# Altium project Tutorial.PrjPcb
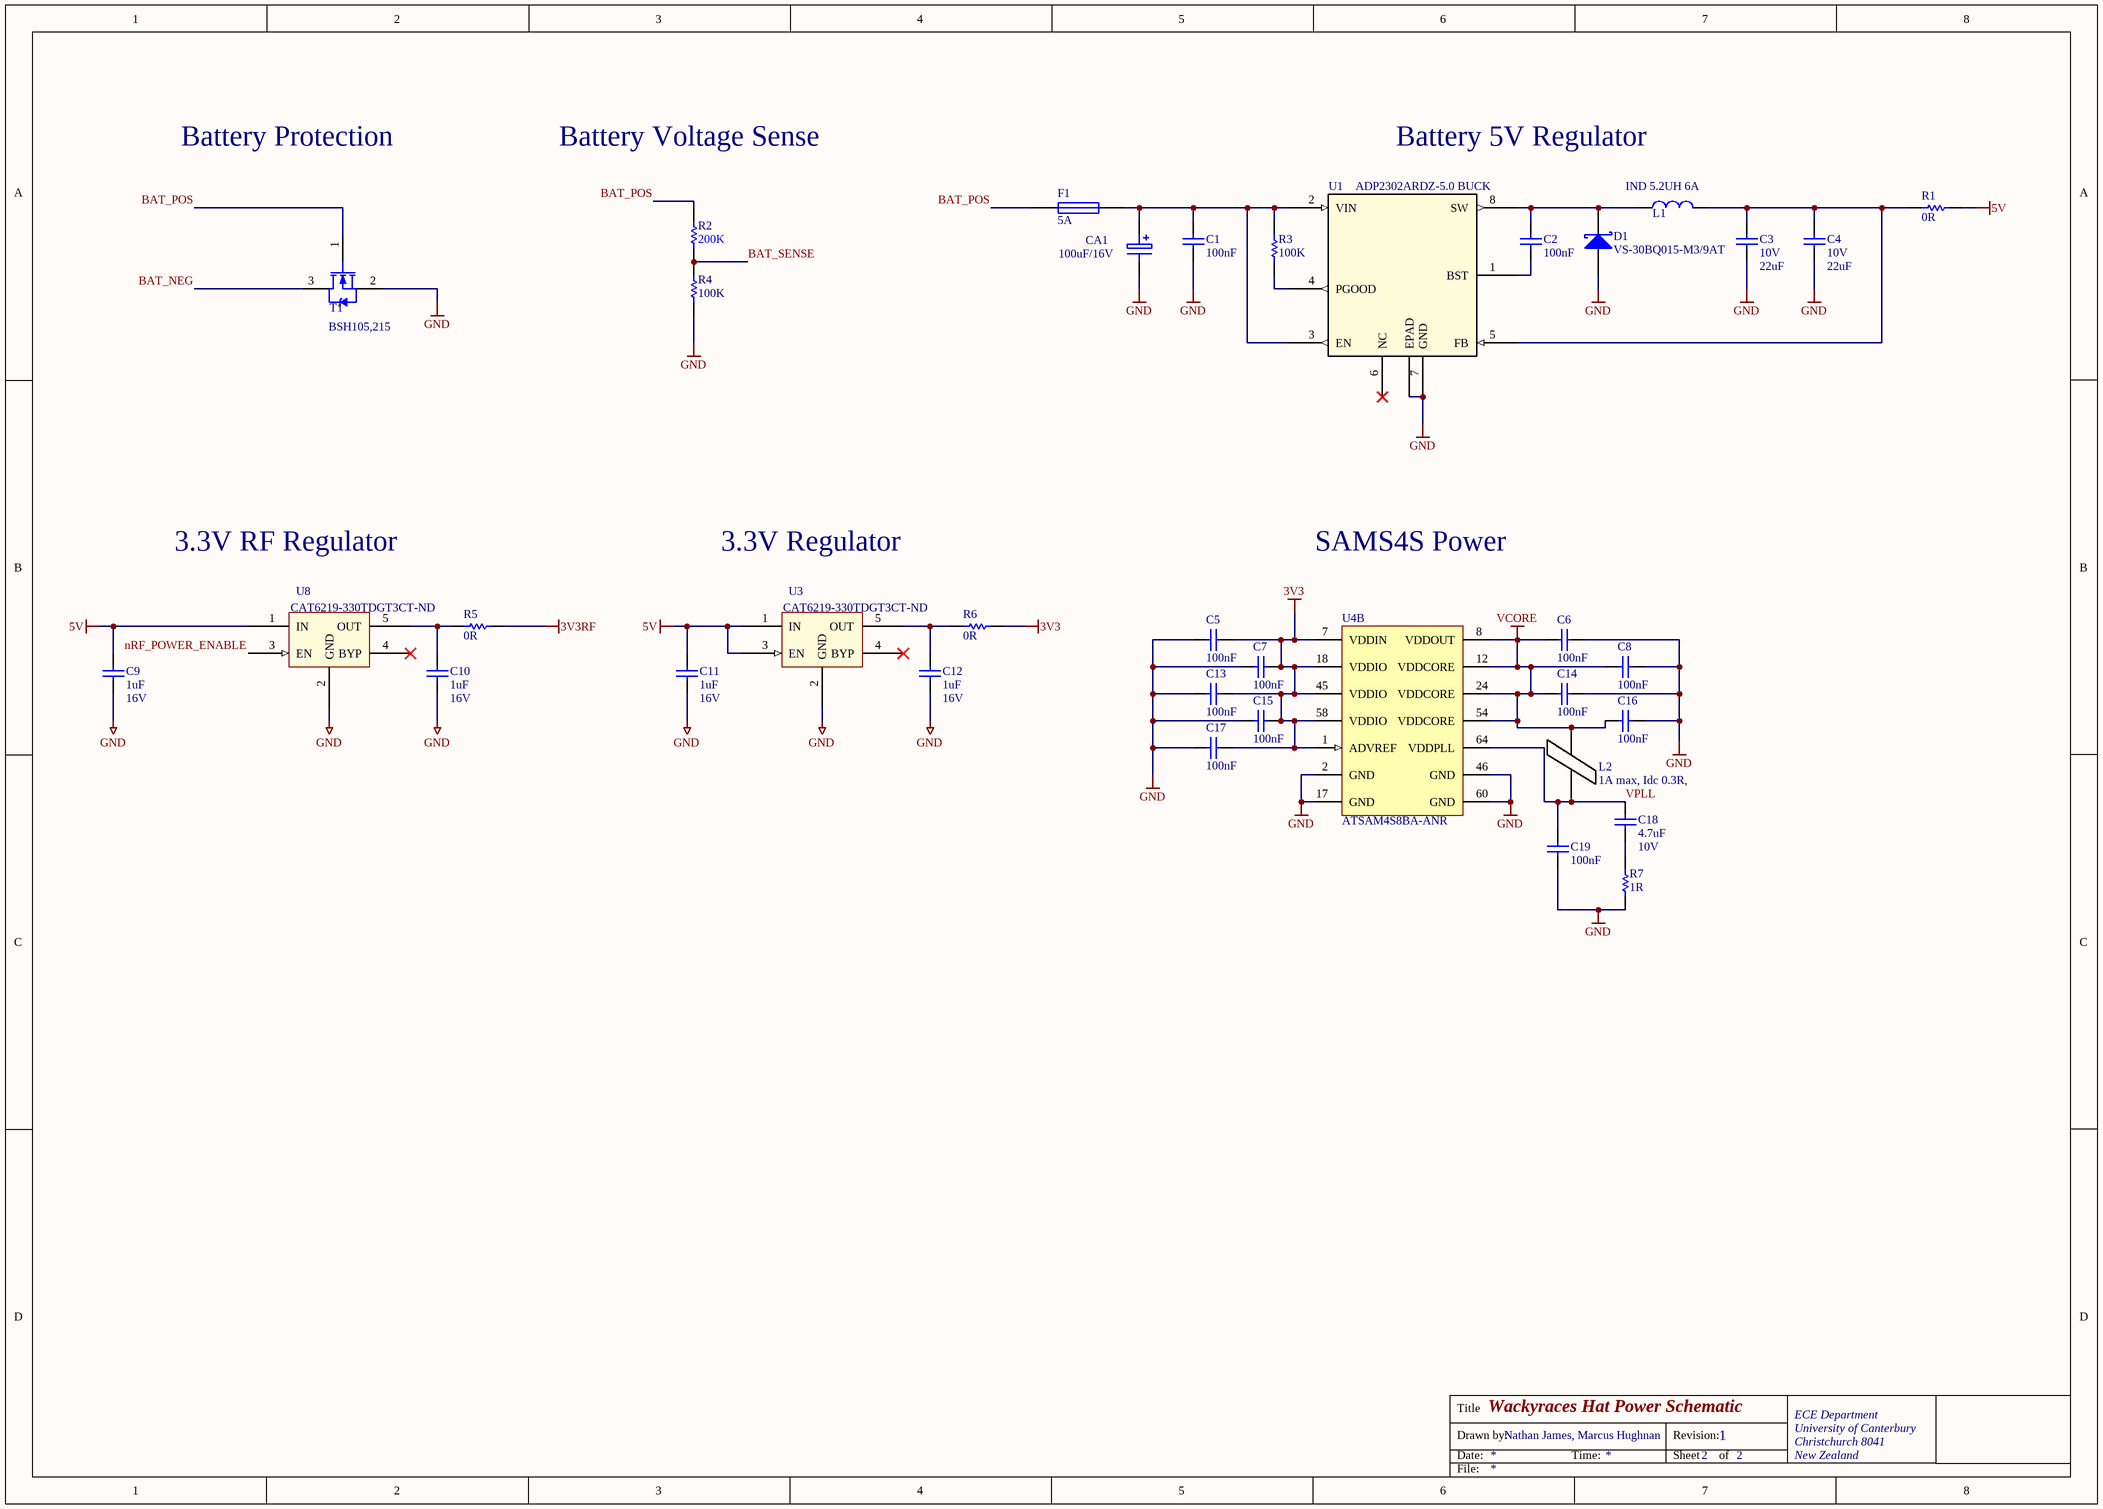
[diagram p0: Power Sheet.SchDoc]
2 sheets, 69 parts. Net scope: global (net labels, ports and power ports of the same name join across sheets).
Board file: hat_template 2020V3.PcbDoc
Sheets:
  Power Sheet.SchDoc
  Main Sheet.SchDoc

## Sheet Power Sheet.SchDoc: Wackyraces Hat Power Schematic
size A3; DrawnBy: Nathan James, Marcus Hughnan; Address1: ECE Department; Address2: University of Canterbury; Address3: Christchurch 8041; Address4: New Zealand; Revision: 1; SheetNumber: 2; SheetTotal: 2

### Parts
C1  100nF  [CAPC1608L]
C2  100nF  [CAPC1608L]
C3  Max Voltage: 10V  [CAPC3216L]  (hidden comment: 22uF)
C4  Max Voltage: 10V  [CAPC3216L]  (hidden comment: 22uF)
C5  100nF  [CAPC1608L]
C6  100nF  [CAPC1608L]
C7  100nF  [CAPC1608L]
C8  100nF  [CAPC1608L]
C9  Max Voltage: 16V  [CAPC1608L]  (hidden comment: 1uF)
C10  Max Voltage: 16V  [CAPC1608L]  (hidden comment: 1uF)
C11  Max Voltage: 16V  [CAPC1608L]  (hidden comment: 1uF)
C12  Max Voltage: 16V  [CAPC1608L]  (hidden comment: 1uF)
C13  100nF  [CAPC1608L]
C14  100nF  [CAPC1608L]
C15  100nF  [CAPC1608L]
C16  100nF  [CAPC1608L]
C17  100nF  [CAPC1608L]
C18  Max Voltage: 10V  [CAPC1608N]  (hidden comment: 4.7uF)
C19  100nF  [CAPC1608L]
CA1  100uF/16V  [NICH-1]
D1  VS-30BQ015-M3/9AT  [SMC]
F1  5A  [RESC3216N]
L1  IND 5.2UH 6A  [INDUCTOR5u2]
L2  1A max, Idc 0.3R,  [INDC3216L]
R1  0R  [RESC1608L]
R2  200K  [RESC1608L]
R3  100K  [RESC1608L]
R4  100K  [RESC1608L]
R5  0R  [RESC1608L]
R6  0R  [RESC1608L]
R7  1R  [RESC3216L]
T1  BSH105,215  [SOT23_L]
U1  ADP2302ARDZ-5.0 BUCK  [RD_8_1]
U3  Supplier Part Number: CAT6219-330TDGT3CT-ND  [SOT95P280X145-5N]  (hidden comment: CAT6219-330TDGT3)
U4  ATSAM4S8BA-ANR  [LQFP64_L]  (part B of 2)
U8  Supplier Part Number: CAT6219-330TDGT3CT-ND  [SOT95P280X145-5N]  (hidden comment: CAT6219-330TDGT3)

### Nets
3V3: C5.2 C7.2 C13.2 C15.2 C17.2 R6.2 U4.1(ADVREF) U4.7(VDDIN) U4.18(VDDIO) U4.45(VDDIO) U4.58(VDDIO)
3V3RF: R5.2
5V: C9.2 C11.2 R1.2 U3.1(IN) U3.3(EN) U8.1(IN)
GND: C1.1 C3.1 C4.1 C5.1 C6.2 C7.1 C8.2 C9.1 C10.1 C11.1 C12.1 C13.1 C14.2 C15.1 C16.2 C17.1 C19.1 CA1.1 D1.1(A) R4.1 R7.1 T1.2 U1.7(GND) U1.EPAD U3.2(GND) U4.2(GND) U4.17(GND) U4.46(GND) U4.60(GND) U8.2(GND)
VCORE: C6.1 C8.1 C14.1 C16.1 L2.2 U4.8(VDDOUT) U4.12(VDDCORE) U4.24(VDDCORE) U4.54(VDDCORE)
BAT_NEG: T1.3
BAT_POS: F1.1 R2.2 T1.1
BAT_SENSE: R2.1 R4.2
nRF_POWER_ENABLE: U8.3(EN)
VPLL: C18.2 C19.2 L2.1 U4.64(VDDPLL)
NetC1_2: C1.2 CA1.2 F1.2 R3.1 U1.2(VIN) U1.3(EN)
NetC2_1: C2.1 U1.1(BST)
NetC2_2: C2.2 D1.2(K) L1.1 U1.8(SW)
NetC3_2: C3.2 C4.2 L1.2 R1.1 U1.5(FB)
NetC10_2: C10.2 R5.1 U8.5(OUT)
NetC12_2: C12.2 R6.1 U3.5(OUT)
NetC18_1: C18.1 R7.2
NetR3_2: R3.2 U1.4(PGOOD)

Not connected (* = marked no-connect by the designer): U1 6(NC)*; U3 4(BYP)*; U8 4(BYP)*

### Notes on the sheet
- Battery Protection
- Battery Voltage Sense
- Battery 5V Regulator
- 3.3V RF Regulator
- 3.3V Regulator
- SAMS4S Power
- Title
- Drawn by:
- Date:
- Time:
- Revision:
- Sheet
- of
- File:

### Library data of the parts
C1 C2 C5-C8 C13-C17 C19 = CC_100nF_0603: CAP CER 100nF X7R +-10% 50V 0603; PackageReference: 0603; Code_IPC: 1608 [0603]; Verify: *; Supplier: ECE Dept; Storage Location: PCB Assembly WS; Value: 100nF
C3 C4 = CC_22uF_1206: CAP CER 22uF Y5V -20% +80% 10V 1206; Verify: *; Supplier: ECE Dept; Storage Location: PCB Assembly WS; Dielectric: Y5V; Footprint: 1206 (3216 metric); Value: 22uF
C9-C12 = CC_1uF_0603: CAP CER 1uF Y5V -20% +80% 16V 0603; PackageReference: 0603; Code_IPC: 1608 [0603]; Verify: *; Supplier: ECE Dept; Storage Location: PCB Assembly WS; Value: 1uF
C18 = CC_4.7uF_0603: CAP CER 4.7uF X5R +-20%  10V 0603; Note: Footprint corresponds to dimensions for bulk cassette packaging. This case size has tightened tolerances.; PackageReference: 0805; Code_IPC: 2012[0805]; Verify: *; Supplier: ECE Dept; Storage Location: PCB Assembly WS; Value: 4.7uF
CA1 = CA_100uF_16V: CAP ALUM 100uF 16V SMD; Manufacturer PN: UWX1C101MCL1GB; Manufacturer: Nichcon; Supplier 1: Farnell; Supplier Part Number 1: 1870677; Storage Location: PCB Assembly WS; Supplier: ECE Dept; Supplier 2: Digi-Key; Supplier Part Number 2: 493-2105-1-ND; Value: 100uF/16V
D1 = DS_VS-30BQ015-M3: DIODE, SCHOTTKY, 3A, 15V, DO-214AB / SMC; Manufacturer: Vishay Semiconductors; Forward Voltage: 350mV; Max Forward Surge Current (Ifsm): 650A; Peak Reverse Current: 4mA; Average Rectified Current: 3A; Max Reverse Voltage (DC): 15V; Supplier: Digi-Key; ComponentLink1URL: https://datasheet.ciiva.com/36181/vs-30bq015-m3-9at-36181258.pdf; ComponentLink1Description: https://datasheet.ciiva.com/36181/vs-30bq015-m3-9at-36181258.pdf; Supplier 1: Digi-Key; Supplier 2: Element14; Supplier Part Number 1: VS-30BQ015-M3/9ATGIDKR-ND; Supplier Part Number 2: 2628288; Supplier Part Number: VS-30BQ015-M3/9AT-ND; Manufacturer Part Number: VS-30BQ015-M3/9AT
F1 = FS_Fuse_5.0A: Fuse 5.0A Fast Acting 1206 SMD; Manufacturer Part Number: C1F5; Manufacturer: Bel TRP; Voltage Rating (AC): 125V; Voltage Rating (DC): 63V; DC Cold Resistance: 19mR; Fuse Type: Board Mount (Cartridge Style Excluded); Approvals: CE,cURus; Mount: Surface Mount; Case/Package: 1206; Number of Pins: 2; Case Code (Metric): 3216; Case Code (Imperial): 1206; Contact Plating: Nickel,Tin; Min Operating Temperature: -55°C; Max Operating Temperature: 125°C; Packaging: Tape and Reel; Voltage Rating: 125V; Length: 0.126inch; Width: 0.062inch; Supplier 1: Digi-Key; Stock 1: 725; Pricing 1: 1=0.32, 5=0.312, 10=0.298, 50=0.2662, 100=0.2479, 250=0.22032, 500=0.1836, 1000=0.17442 (USD); ComponentLink1URL: http://www.farnell.com/datasheets/2571625.pdf; ComponentLink1Description: http://www.farnell.com/datasheets/2571625.pdf; ComponentLink2URL: http://belfuse.com/pdfs/C1F.pdf; ComponentLink2Description: http://belfuse.com/pdfs/C1F.pdf; ComponentLink3URL: http://www.mouser.com/ds/2/643/C1F-594910.pdf; ComponentLink3Description: http://www.mouser.com/ds/2/643/C1F-594910.pdf; ComponentLink4URL: https://belfuse.com/resources/StewartConnector/C1F.pdf; ComponentLink4Description: https://belfuse.com/resources/StewartConnector/C1F.pdf; Current Rating: 5A; Supplier Part Number 1: 507-1886-1-ND; Supplier 2: Element14; Supplier Part Number 2: 2848595; Value: 5A
L1 = CDRH104RNP-5R2NC: FIXED IND 5.2UH 6A 22 MOHM SMD; Manufacturer: Sumida America Components Inc.; Material - Core: Ferrite; Tolerance: ±30%; Current - Saturation: 5.6A; Shielding: Shielded; DC Resistance (DCR): 22 mOhm Max; Supplier 1: Digi-Key; Manufacturer Part Number: CDRH104RNP-5R2NC; RoHS: RoHS Compliant; Category: Inductors, Coils, Chokes; Stock 1: 3849; Pricing 1: 1=2.9, 10=2.678, 100=1.8743, 500=1.5173 (NZD); Packaging: Cut Tape (CT); Part Status: Active; Type: -; Q @ Freq: -; Frequency - Self Resonant: -; Ratings: -; Operating Temperature: -40°C ~ 100°C; Mounting Type: Surface Mount; Package / Case: Nonstandard; Supplier Device Package: -; Size / Dimension: 0.402" L x 0.394" W (10.20mm x 10.00mm); Height - Seated (Max): 0.157" (4.00mm); ComponentLink1URL: http://products.sumida.com/products/pdf/CDRH104R.pdf; ComponentLink1Description: http://products.sumida.com/products/pdf/CDRH104R.pdf; Supplier Part Number 1: 308-2280-1-ND
L2 = IN_Ferrite-Bead: Ferrite Bead, Rdc 0.3R, Z100MHZ 600R, Imax 1A, SMD 1206; Manufacturer: FAIR-RITE; Manufacturer PN: 2512066017Y1; DC Current Rating: 1; DC Resistance Max: 0.08; Ferrite Case Style: 1206 ^3216 Metric]; Frequency Range: 50MHz to 1; Impedance: 600; Impedance Tolerance: ± 25%; Supplier: ECE Dept; Storage Location: PCB Assembly WS; Ferrite Mounting: SMD; Supplier 1: Farnell; Supplier Part Number 1: 1612060; Manufacturer Part Number: 2512066017Y1; Value: 1A max, Idc 0.3R,
R1 R5 R6 = RS_0R0: RES 0.0 OHM 1/10W 5% 0603 SMD; Storage Location: PCB Assembly WS; Supplier: ECE Dept; Value: 0R
R2 = RS_200K: RES 200K OHM 1/10W 5% 0603 SMD; Storage Location: PCB Assembly WS; Supplier: ECE Dept; Value: 200K
R3 R4 = RS_100K: RES 100K OHM 1/10W 5% 0603 SMD; Storage Location: PCB Assembly WS; Supplier: ECE Dept; Value: 100K
R7 = RT_1R: RES 1R OHM 1/4W 5% 1206 SMD; Storage Location: PCB Assembly WS; Supplier: ECE Dept; Value: 1R
T1 = TM_BSH105: MOSFET N-CH 20V 1.05A SOT-23; Manufacturer: NXP Semiconductors; FET Type: MOSFET N-Channel, Metal Oxide; Gate Charge (Qg) @ Vgs: 3.9nC @ 4.5V; Input Capacitance (Ciss) @ Vds: 152pF @ 16V; Power - Max: 417mW; Rds On (Max) @ Id, Vgs: 200 mOhm @ 600mA, 4.5V; Supplier 1: Farnell; Supplier 2: Digi-Key; Current - Continuous Drain (Id) @ 25° C: 1.05A; Drain to Source Voltage (Vdss): 20V; Package / Case: TO-236-3, SC-59, SOT-23-3; Pricing: 1=0.53, 10=0.42, 25=0.3544, 100=0.2885, 250=0.23896, 500=0.1974, 1000=0.14785 (NZD); Supplier Part Number 1: 1758066; Supplier Part Number 2: 568-6215-1-ND; Storage Location: PCB Assembly WS; Supplier: ECE Dept; Manufacturer Part Number: BSH105,215
U1 = ADP2302ARDZ-5.0-R7: IC REG BUCK 5V 2A 8SOIC; Vendor: Analog Devices Inc; Frequency - Switching: 700kHz; Output Type: Fixed; Voltage - Input (Max): 20V; Manufacturer_Part_Number: ADP2302ARDZ-5.0-R7; Type: DEV; Value: Value; Supplier 1: Digi-Key; Current - Output: 2A; Voltage - Output (Min/Fixed): 5V; Supplier Part Number 1: ADP2302ARDZ-5.0-R7CT-ND
U3 U8 = SV_CAT6219-330TDGT3: IC REG LIN 3.3V 500MA TSOT23-5; Voltage - Input (Max): 5.5V; Voltage Dropout (Max): 0.5V @ 500mA; Manufacturer Part Number: CAT6219-330TDGT3; Base Part Number: CAT6219; Current - Output: 500mA; Package / Case: SOT-23-5 Thin, TSOT-23-5; Supplier: Digi-Key; Supplier Device Package: TSOT-23-5; Voltage - Output (Min/Fixed): 3.3V; ComponentLink1URL: http://www.onsemi.com/pub/Collateral/CAT6219-D.PDF; ComponentLink1Description: http://www.onsemi.com/pub/Collateral/CAT6219-D.PDF; Supplier 1: Digi-Key
U4 = SE_ATSAM4S16BA-MU: IC MCU 32BIT 512KB FLASH 64LQFP; Manufacturer: Atmel; Connectivity: I²C, IrDA, Memory Card, SPI, SSC, UART/USART, USB; Core Processor: ARM® Cortex®-M4; Core Size: 32-Bit; Data Converters: A/D 11x12b, D/A 2x12b; Number of I/O: 47; Peripherals: Brown-out Detect/Reset, DMA, POR, PWM, WDT; Program Memory Size: 512KB (512K x 8); RAM Size: 128K x 8; Speed: 120MHz; Voltage - Supply (Vcc/Vdd): 1.62 V ~ 3.6 V; PackageVersion: revJ, Jul-2007; PackageReference: 64PS; PackageDescription: 64-Pin Quad Flat No-Lead (QFN) Sawn, 9 x 9 x 1.0 mm Body, 0.5 mm Pitch, Exposed Pad; Code_JEDEC: MO-220VMMD-3; ComponentLink1Description: Manufacturer URL; ComponentLink1URL: http://www.atmel.com/; ComponentLink2Description: SAM4S Series Datasheet; ComponentLink2URL: http://www.atmel.com/dyn/resources/prod_documents/11100.pdf; ComponentLink3Description: SAM4S Series Summary; ComponentLink3URL: http://www.atmel.com/dyn/resources/prod_documents/11100S.pdf; Supplier 1: Digi-Key; Package / Case: 64-LQFP; Packaging: Cut Tape (CT); Program Memory Type: FLASH; Supplier Part Number 1: ATSAM4S8BA-ANRCT-ND; Manufacturer Part Number: ATSAM4S8BA-ANR

## Sheet Main Sheet.SchDoc: Wackyraces Hat Main Schemetic
size A3; DrawnBy: Nathan James, Marcus Hughnan; Address1: ECE Department; Address2: University of Canterbury; Address3: Christchurch 8041; Address4: New Zealand; Revision: 1; SheetNumber: 1; SheetTotal: 2
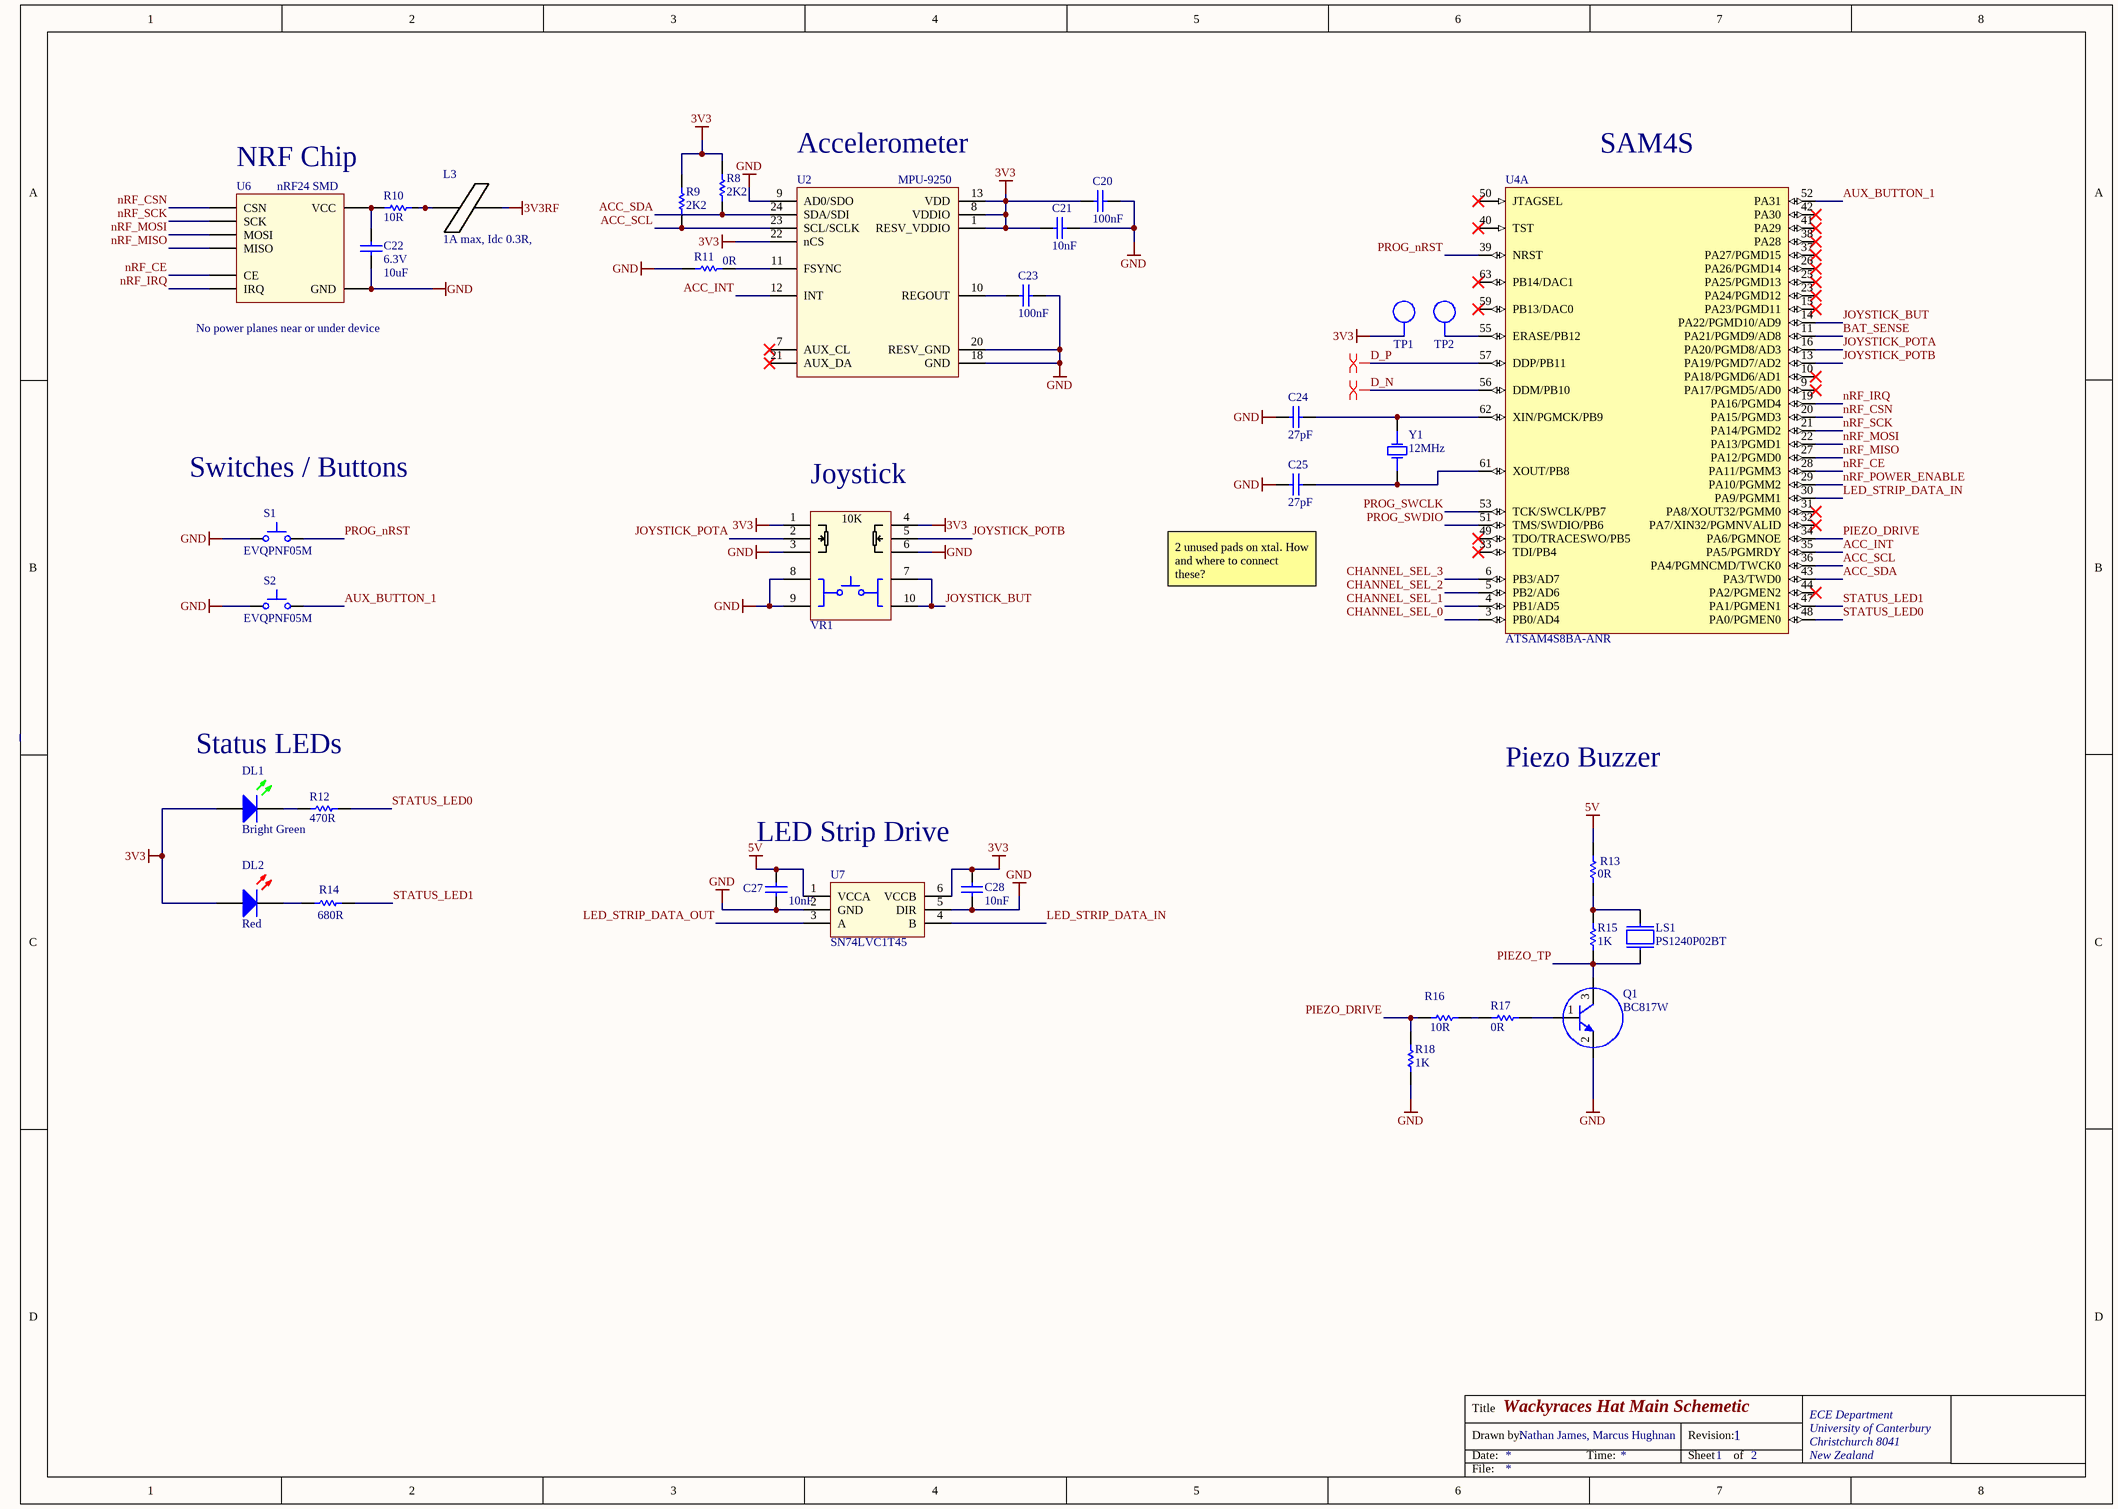
[diagram p1: Main Sheet.SchDoc]

### Parts
C20  100nF  [CAPC1608L]
C21  10nF  [CAPC1608L]
C22  Voltage - Rated: 6.3V  [CAPC1608L]  (hidden comment: 10uF)
C23  100nF  [CAPC1608L]
C24  27pF  [CAPC1608L]
C25  27pF  [CAPC1608L]
C27  10nF  [CAPC1608L]
C28  10nF  [CAPC1608L]
DL1  Bright Green  [WL-SMCW0603]
DL2  Red  [WL-SMCW0603]
L3  1A max, Idc 0.3R,  [INDC3216L]
LS1  PS1240P02BT  [XDCR_PS1240P02BT]
Q1  BC817W  [SOT323_M]
R8  2K2  [RESC1608L]
R9  2K2  [RESC1608L]
R10  10R  [RESC1608L]
R11  0R  [RESC1608L]
R12  470R  [RESC1608L]
R13  0R  [RESC1608L]
R14  680R  [RESC1608L]
R15  1K  [RESC1608L]
R16  10R  [RESC1608L]
R17  0R  [RESC1608L]
R18  1K  [RESC1608L]
S1  EVQPNF05M  [EVQPNF05M]
S2  EVQPNF05M  [EVQPNF05M]
TP1  Erase  [TP_1206]  (value not drawn)  (no BOM)
TP2  Erase  [TP_1206]  (value not drawn)  (no BOM)
U2  MPU-9250  [Quad24]
U4  ATSAM4S8BA-ANR  [LQFP64_L]  (part A of 2)
U6  nRF24 SMD  Warning: No power planes near or under device  [NRF24]
U7  SN74LVC1T45  [SOT23-6_N]
VR1  Joystick 10k with Sw  [Joystick_Sw]  (value not drawn)
Y1  12MHz  [6.0X3.5-4]

### Nets
3V3: C20.1 C21.1 C28.2 DL1.2(A) DL2.2(A) R8.2 R9.1 TP1.1 U2.1(RESV_VDDIO) U2.8(VDDIO) U2.13(VDD) U2.22(nCS) U7.6(VCCB) VR1.1 VR1.4(1')
3V3RF: L3.1
5V: C27.2 R13.2 U7.1(VCCA)
GND: C20.2 C21.2 C22.1 C23.2 C24.1 C25.1 C27.1 C28.1 Q1.2 R11.1 R18.1 S1.1 S2.1 U2.9(AD0/SDO) U2.18(GND) U2.20(RESV_GND) U6.2(GND) U7.2(GND) U7.5(DIR) VR1.3 VR1.6(3') VR1.8 VR1.9
ACC_INT: U2.12(INT) U4.35(PA5/PGMRDY)
ACC_SCL: R9.2 U2.23(SCL/SCLK) U4.36(PA4/PGMNCMD/TWCK0)
ACC_SDA: R8.1 U2.24(SDA/SDI) U4.43(PA3/TWD0)
AUX_BUTTON_1: S2.2 U4.52(PA31)
BAT_SENSE: U4.11(PA21/PGMD9/AD8)
CHANNEL_SEL_0: U4.3(PB0/AD4)
CHANNEL_SEL_1: U4.4(PB1/AD5)
CHANNEL_SEL_2: U4.5(PB2/AD6)
CHANNEL_SEL_3: U4.6(PB3/AD7)
D_N: U4.56(DDM/PB10)
D_P: U4.57(DDP/PB11)
JOYSTICK_BUT: U4.14(PA22/PGMD10/AD9) VR1.7 VR1.10
JOYSTICK_POTA: U4.16(PA20/PGMD8/AD3) VR1.2
JOYSTICK_POTB: U4.13(PA19/PGMD7/AD2) VR1.5(2')
LED_STRIP_DATA_IN: U4.30(PA9/PGMM1) U7.4(B)
LED_STRIP_DATA_OUT: U7.3(A)
nRF_CE: U4.28(PA11/PGMM3) U6.3(CE)
nRF_CSN: U4.20(PA15/PGMD3) U6.4(CSN)
nRF_IRQ: U4.19(PA16/PGMD4) U6.8(IRQ)
nRF_MISO: U4.27(PA12/PGMD0) U6.7(MISO)
nRF_MOSI: U4.22(PA13/PGMD1) U6.6(MOSI)
nRF_POWER_ENABLE: U4.29(PA10/PGMM2)
nRF_SCK: U4.21(PA14/PGMD2) U6.5(SCK)
PIEZO_DRIVE: R16.1 R18.2 U4.34(PA6/PGMNOE)
PIEZO_TP: LS1.1 Q1.3 R15.1
PROG_nRST: S1.2 U4.39(NRST)
PROG_SWCLK: U4.53(TCK/SWCLK/PB7)
PROG_SWDIO: U4.51(TMS/SWDIO/PB6)
STATUS_LED0: R12.2 U4.48(PA0/PGMEN0)
STATUS_LED1: R14.2 U4.47(PA1/PGMEN1)
NetC22_2: C22.2 R10.1 U6.1(VCC)
NetC23_1: C23.1 U2.10(REGOUT)
NetC24_2: C24.2 U4.62(XIN/PGMCK/PB9) Y1.3(OSC2)
NetC25_2: C25.2 U4.61(XOUT/PB8) Y1.1(OSC1)
NetDL1_1: DL1.1(K) R12.1
NetDL2_1: DL2.1(K) R14.1
NetL3_2: L3.2 R10.2
NetLS1_2: LS1.2 R13.1 R15.2
NetQ1_1: Q1.1 R17.2
NetR11_2: R11.2 U2.11(FSYNC)
NetR16_2: R16.2 R17.1
NetTP2_1: TP2.1 U4.55(ERASE/PB12)

Not connected (* = marked no-connect by the designer): U2 7(AUX_CL)* 21(AUX_DA)*; U4 9(PA17/PGMD5/AD0)* 10(PA18/PGMD6/AD1)* 15(PA23/PGMD11)* 23(PA24/PGMD12)* 25(PA25/PGMD13)* 26(PA26/PGMD14)* 31(PA8/XOUT32/PGMM0)* 32(PA7/XIN32/PGMNVALID)* 33(TDI/PB4)* 37(PA27/PGMD15)* 38(PA28)* 40(TST)* 41(PA29)* 42(PA30)* 44(PA2/PGMEN2)* 49(TDO/TRACESWO/PB5)* 50(JTAGSEL)* 59(PB13/DAC0)* 63(PB14/DAC1)*

### Layout directives
differential pair: D_N, D_P

### Notes on the sheet
- NRF Chip
- (near U2) Accelerometer
- (near U4) SAM4S
- Switches / Buttons
- (near VR1) Joystick
- (near C25) 2 unused pads on xtal. How and where to connect these?
- Status LEDs
- Piezo Buzzer
- LED Strip Drive
- Title
- Drawn by:
- Date:
- Time:
- Revision:
- Sheet
- of
- File:
- (in symbol Joystick 10k with Sw) 10K

### Library data of the parts
C20 C23 = CC_100nF_0603: CAP CER 100nF X7R +-10% 50V 0603; PackageReference: 0603; Code_IPC: 1608 [0603]; Verify: *; Supplier: ECE Dept; Storage Location: PCB Assembly WS; Value: 100nF
C21 C27 C28 = CC_10nF_0603: CAP CER 10nF X7R +-10% 50V 0603; PackageReference: 0603; Code_IPC: 1608 [0603]; Verify: *; Supplier: ECE Dept; Storage Location: PCB Assembly WS; Value: 10nF
C22 = CC_10uF_0603: CAP CER 10UF X5R +-20% 6V3 0603; Supplier: ECE Dept; Storage Location: PCB Assembly WS; Value: 10uF
C24 C25 = CC_27pF_0603: CAP CER 27pF NPO/COG +-5% 50V 0603; PackageReference: 0603; Code_IPC: 1608 [0603]; Verify: *; Supplier: ECE Dept; Storage Location: PCB Assembly WS; Value: 27pF
DL1 = DL_150060VS75000: LED Bright Green 40mcd 0603 SMD; Manufacturer: WURTH ELEKTRONIK; Forward Current If: 30; Forward Voltage: 2; Viewing Angle: 140°; Wavelength Typ: 570; Luminous Intensity: 40; LED Mounting: SMD; Supplier 1: Farnell; Supplier Part Number 1: 2322073; Manufacturer Part Number: 150060VS75000; Storage Location: PCB Assembly WS; Supplier: ECE Dept; LED Colour: Bright Green
DL2 = DL_150060RS75000: LED Red 250mcd 0603 SMD; Manufacturer: WURTH ELEKTRONIK; Forward Current If: 30; Forward Voltage: 2; Lens Shape: Rectangular; Luminous Intensity: 250; Wavelength Typ: 625; Viewing Angle: 140°; LED Mounting: SMD; Supplier 1: Farnell; Supplier Part Number 1: 2322071; Manufacturer Part Number: 150060RS75000; Storage Location: PCB Assembly WS; Supplier: ECE Dept; LED Colour: Red
L3 = IN_Ferrite-Bead: as L2 on sheet Power Sheet; Supplier: ECE Dept; Storage Location: PCB Assembly WS; Ferrite Mounting: SMD; Supplier 1: Farnell; Supplier Part Number 1: 1612060; Manufacturer Part Number: 2512066017Y1; Value: 1A max, Idc 0.3R,
LS1 = PS1240P02BT: Buzzers Transducer, Externally Driven Piezo 3V 4kHz 60dB @ 3V, 10cm Through Hole PC Pins; MF: TDK; MP: PS1240P02BT; Availability: Unavailable; Package: 2020 TDK; Value: *; Price: None; SnapEDA_Link: https://www.snapeda.com/parts/PS1240P02BT/TDK/view-part/53420/?ref=snap
Q1 = TB_BC817W: NPN GP Bipolar Transistor 45V 500mA SOT323; Manufacturer: NXP; Supplier 1: Farnell; Supplier Part Number 1: 2114873; Manufacturer PN: BC817W; Storage Location: PCB Assembly WS; Supplier: ECE Dept; Value: BC817W
R8 R9 = RS_2K2: RES 2.2K OHM 1/10W 5% 0603 SMD; Storage Location: PCB Assembly WS; Supplier: ECE Dept; Value: 2K2
R10 R16 = RS_10R: RES 10 OHM 1/10W 5% 0603 SMD; Storage Location: PCB Assembly WS; Supplier: ECE Dept; Value: 10R
R11 R13 R17 = RS_0R0: RES 0.0 OHM 1/10W 5% 0603 SMD; Storage Location: PCB Assembly WS; Supplier: ECE Dept; Value: 0R
R12 = RS_470R: RES 470 OHM 1/10W 5% 0603 SMD; Storage Location: PCB Assembly WS; Supplier: ECE Dept; Value: 470R
R14 = RS_680R: RES 680 OHM 1/10W 5% 0603 SMD; Storage Location: PCB Assembly WS; Supplier: ECE Dept; Value: 680R
R15 R18 = RS_1K: RES 1.0K OHM 1/10W 5% 0603 SMD; Storage Location: PCB Assembly WS; Supplier: ECE Dept; Value: 1K
S1 S2 = WS_EVQPNF05M: Panasonic 6 x 3.5mm SMD Light Touch Switch Type SMD; PackageDescription: 6.0 x 3.5 mm; Supplier 1: Farnell; Supplier Part Number 1: 2079481; Manufacturer: Panasonic; Manufacturer PN: EVQPNF05M; Supplier 2: Digi-Key; Supplier Part Number 2: P13598SCT-ND; Storage Location: PCB Assembly WS; Supplier: ECE Dept
TP1 TP2 = TP_1206: Test-Point 3.3x1.6x2.1mm SMD; Manufacturer: Harwin Inc; Manufacturer Part Number: S1751-46R; Value: TP; Manufacturer PN: *; Storage Location: ProtoPlace; Mounting Type: Surface Mount; Type: PC Test Point; Supplier 1: Digi-Key; Supplier Part Number 1: 952-1478-2-ND; Supplier 2: Farnell; Supplier Part Number 2: 1826282; Supplier: ECE Dept
U2 = MPU-9250: 9 axis IMU
U4 = SE_ATSAM4S16BA-MU: as U4 on sheet Power Sheet; PackageVersion: revJ, Jul-2007; PackageReference: 64PS; PackageDescription: 64-Pin Quad Flat No-Lead (QFN) Sawn, 9 x 9 x 1.0 mm Body, 0.5 mm Pitch, Exposed Pad; Code_JEDEC: MO-220VMMD-3; ComponentLink1Description: Manufacturer URL; ComponentLink1URL: http://www.atmel.com/; ComponentLink2Description: SAM4S Series Datasheet; ComponentLink2URL: http://www.atmel.com/dyn/resources/prod_documents/11100.pdf; ComponentLink3Description: SAM4S Series Summary; ComponentLink3URL: http://www.atmel.com/dyn/resources/prod_documents/11100S.pdf; Supplier 1: Digi-Key; Package / Case: 64-LQFP; Packaging: Cut Tape (CT); Program Memory Type: FLASH; Supplier Part Number 1: ATSAM4S8BA-ANRCT-ND; Manufacturer Part Number: ATSAM4S8BA-ANR
U6 = NRF24: nRF24 SMD Module
U7 = SN74LVC1T45: 1.8V - 5V level converter
VR1 = Joystick 10k with Sw: JOYSTICK 10K OHM 2 AXIS TH; Manufacturer 1: SparkFun; Manufacturer Part Number 1: COM-09032; Supplier 1: Digi-Key; Stock 1: 563; Pricing 1: 1=3.95000 (USD); RoHS: No; ComponentLink1URL: https://media.digikey.com/pdf/Data%20Sheets/Sparkfun%20PDFs/COM-09032_Web.pdf?src-supplier=Digi-Key; ComponentLink1Description: https://media.digikey.com/pdf/Data%20Sheets/Sparkfun%20PDFs/COM-09032_Web.pdf?src-supplier=Digi-Key; Supplier Part Number 1: 1568-1526-ND
Y1 = XT_CRYSTAL_12MHz_18pF: CRYSTAL 12MHZ 18PF 6X3.5mm SMD; Manufacturer: CTS-Frequency Controls; Manufacturer Part Number: 406C35D12M00000; ESR (Equivalent Series Resistance): 60 Ohm; Frequency Stability: ±50ppm; Frequency Tolerance: ±30ppm; Operating Mode: Fundamental; Supplier 1: Digi-Key; Height: 0.047" (1.20mm); Load Capacitance: 18pF; Mounting Type: Surface Mount; Operating Temperature: -20°C ~ 70°C; Package / Case: 4-SMD, No Lead (DFN, LCC); Size / Dimension: 0.236" L x 0.138" W (6.00mm x 3.50mm); Supplier Part Number 1: CTX855CT-ND; Frequency: 12MHz

## Nets that join several sheets
3V3: Power Sheet (11 pins), Main Sheet (15 pins)
3V3RF: Power Sheet (R5.2), Main Sheet (L3.1)
5V: Power Sheet (6 pins), Main Sheet (C27.2 R13.2 U7.1)
GND: Power Sheet (30 pins), Main Sheet (23 pins)
BAT_SENSE: Power Sheet (R2.1 R4.2), Main Sheet (U4.11)
nRF_POWER_ENABLE: Power Sheet (U8.3), Main Sheet (U4.29)